# EAGLE schematic shupito (EAGLE 5.11)
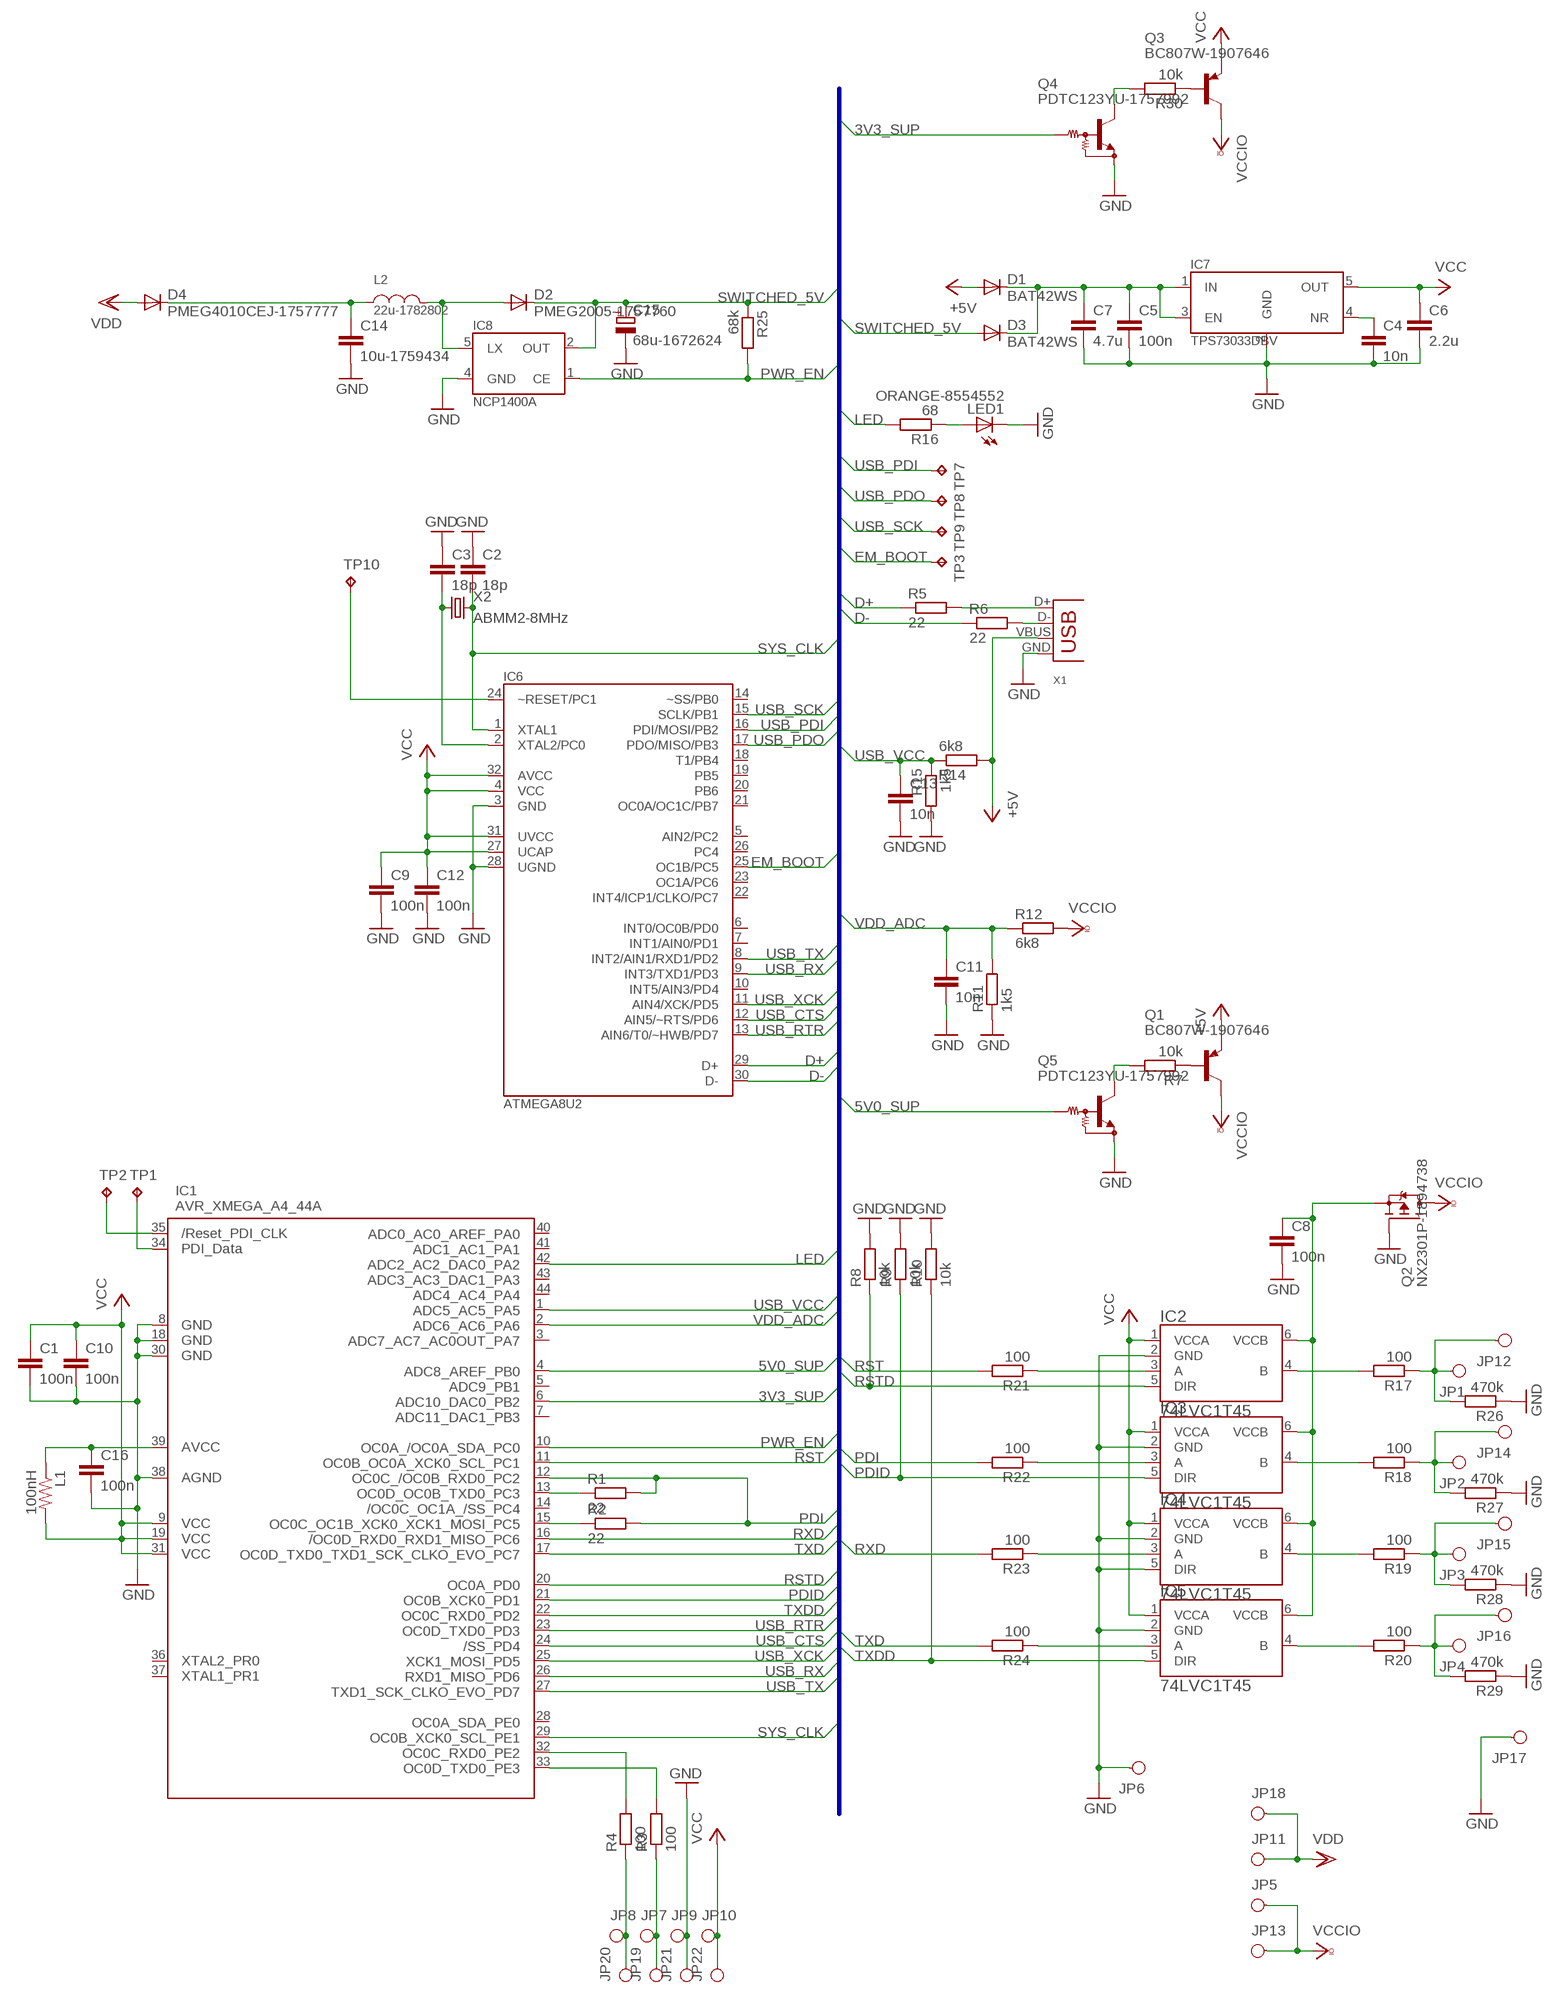
[diagram p0: schematic, sheet 1]

## Parts
C1  100n  C-EUC0603  [C0603]
C2  18p  C-EUC0603  [C0603]
C3  18p  C-EUC0603  [C0603]
C4  10n  C-EUC0603  [C0603]
C5  100n  C-EUC0603  [C0603]
C6  2.2u  C-EUC1206  [C1206]
C7  4.7u  C-EUC1206  [C1206]
C8  100n  C-EUC0603  [C0603]
C9  100n  C-EUC0603  [C0603]
C10  100n  C-EUC0603  [C0603]
C11  10n  C-EUC0603  [C0603]
C12  100n  C-EUC0603  [C0603]
C13  10n  C-EUC0603  [C0603]
C14  10u-1759434  C-EUC1206  [C1206]
C15  68u-1672624  CPOL-EUC/6032-28R  [C/6032-28R]
C16  100n  C-EUC0603  [C0603]
D1  BAT42WS  DIODE-SOD323  [SOD323]
D2  PMEG2005-1757760  DIODE-SOD323  [SOD323]
D3  BAT42WS  DIODE-SOD323  [SOD323]
D4  PMEG4010CEJ-1757777  DIODE-SOD323  [SOD323]
IC1  AVR_XMEGA_A4_44A  [TQFP44]
IC2  74LVC1T45  74LVC1T45DBV  [SOT236]
IC3  74LVC1T45  74LVC1T45DBV  [SOT236]
IC4  74LVC1T45  74LVC1T45DBV  [SOT236]
IC5  74LVC1T45  74LVC1T45DBV  [SOT236]
IC6  ATMEGA8U2  [TQFP32-08]
IC7  TPS73033DBV  [SOT23-DBV]
IC8  NCP1400A  [SOT23-DBV]
JP1  PINH1X01SMD  [PINH1X01SMD]
JP2  PINH1X01SMD  [PINH1X01SMD]
JP3  PINH1X01SMD  [PINH1X01SMD]
JP4  PINH1X01SMD  [PINH1X01SMD]
JP5  PINH1X01SMD  [PINH1X01SMD]
JP6  PINH1X01SMD  [PINH1X01SMD]
JP7  PINH1X01SMD  [PINH1X01SMD]
JP8  PINH1X01SMD  [PINH1X01SMD]
JP9  PINH1X01SMD  [PINH1X01SMD]
JP10  PINH1X01SMD  [PINH1X01SMD]
JP11  PINH1X01SMD  [PINH1X01SMD]
JP12  PINH1X01SMD  [PINH1X01SMD]
JP13  PINH1X01SMD  [PINH1X01SMD]
JP14  PINH1X01SMD  [PINH1X01SMD]
JP15  PINH1X01SMD  [PINH1X01SMD]
JP16  PINH1X01SMD  [PINH1X01SMD]
JP17  PINH1X01SMD  [PINH1X01SMD]
JP18  PINH1X01SMD  [PINH1X01SMD]
JP19  PINH1X01SMD  [PINH1X01SMD]
JP20  PINH1X01SMD  [PINH1X01SMD]
JP21  PINH1X01SMD  [PINH1X01SMD]
JP22  PINH1X01SMD  [PINH1X01SMD]
L1  100nH  R-US_R0603  [R0603]
L2  22u-1782802  L  [1515]
LED1  ORANGE-8554552  LEDCHIPLED_0603  [CHIPLED_0603]
Q1  BC807W-1907646  BC807W  [SOT323-BEC]
Q2  NX2301P-1894738  P-MOSFET-SOT23-GSD  [SOT23]
Q3  BC807W-1907646  BC807W  [SOT323-BEC]
Q4  PDTC123YU-1757992  NPN-BIAS-SOT323-BEC  [SOT323]
Q5  PDTC123YU-1757992  NPN-BIAS-SOT323-BEC  [SOT323]
R1  22  R-EU_R0603  [R0603]
R2  22  R-EU_R0603  [R0603]
R3  100  R-EU_R0603  [R0603]
R4  100  R-EU_R0603  [R0603]
R5  22  R-EU_R1206  [R1206]
R6  22  R-EU_R0603  [R0603]
R7  10k  R-EU_R0603  [R0603]
R8  10k  R-EU_R0603  [R0603]
R9  10k  R-EU_R0603  [R0603]
R10  10k  R-EU_R0603  [R0603]
R11  1k5  R-EU_R0603  [R0603]
R12  6k8  R-EU_R0603  [R0603]
R14  6k8  R-EU_R0603  [R0603]
R15  1k5  R-EU_R0603  [R0603]
R16  68  R-EU_R0603  [R0603]
R17  100  R-EU_R0603  [R0603]
R18  100  R-EU_R0603  [R0603]
R19  100  R-EU_R0603  [R0603]
R20  100  R-EU_R0603  [R0603]
R21  100  R-EU_R0603  [R0603]
R22  100  R-EU_R0603  [R0603]
R23  100  R-EU_R0603  [R0603]
R24  100  R-EU_R0603  [R0603]
R25  68k  R-EU_R0603  [R0603]
R26  470k  R-EU_R0603  [R0603]
R27  470k  R-EU_R0603  [R0603]
R28  470k  R-EU_R0603  [R0603]
R29  470k  R-EU_R0603  [R0603]
R30  10k  R-EU_R0603  [R0603]
TP1  TPTP15SQ  [TP15SQ]
TP2  TPTP15SQ  [TP15SQ]
TP3  TPTP15SQ  [TP15SQ]
TP7  TPTP15SQ  [TP15SQ]
TP8  TPTP15SQ  [TP15SQ]
TP9  TPTP15SQ  [TP15SQ]
TP10  TPTP15SQ  [TP15SQ]
X1  USB-MB-S  [USB-MB-S]
X2  ABMM2-8MHz  XTAL6X3.6_LARGE  [6X3.6_LARGE]

## Nets
3V3_SUP: IC1.6(PB2) Q4.1(B)
5V0_SUP: IC1.4(PB0) Q5.1(B)
+5V: D1.A Q1.2(E) R14.2 X1.VBUS
D+: IC6.29(D+) R5.1
D-: IC6.30(D-) R6.1
EM_BOOT: IC6.25(OC1B/PC5) TP3.TP
GND: C1.2 C2.1 C3.1 C4.2 C5.2 C6.2 C7.2 C8.2 C9.2 C10.2 C11.2 C12.2 C13.2 C14.2 C15.- C16.2 IC1.8(GND1) IC1.18(GND2) IC1.30(GND3) IC1.38(AGND) IC2.2(GND) IC3.2(GND) IC4.2(GND) IC4.5(DIR) IC5.2(GND) IC6.3(GND) IC6.28(UGND) IC7.2(GND) IC8.4(GND) JP6.1 JP9.1 JP17.1 JP21.1 LED1.C Q2.1(G) Q4.2(E) Q5.2(E) R8.2 R9.2 R10.2 R11.1 R15.2 R26.1 R27.1 R28.1 R29.1 X1.GND
LED: IC1.42(PA2) R16.2
N$1: JP7.1 JP19.1 R3.1
N$2: IC1.35(RESET) TP2.TP
N$3: IC1.34(PDI_DATA) TP1.TP
N$4: IC1.15(PC5) R2.1
N$5: IC2.4(B) R17.2
N$6: C16.1 IC1.39(AVCC) L1.1
N$7: JP2.1 JP14.1 R18.1 R27.2
N$8: IC1.13(PC3) R1.1
N$9: IC3.4(B) R18.2
N$10: JP8.1 JP20.1 R4.1
N$11: IC1.32(PE2) R4.2
N$12: IC1.33(PE3) R3.2
N$13: R6.2 X1.D-
N$14: R5.2 X1.D+
N$15: LED1.A R16.1
N$16: C14.1 D4.C L2.1
N$17: C4.1 IC7.4(NR)
N$18: IC6.24(~RESET/PC1) TP10.TP
N$19: Q1.1(B) R7.1
N$21: C5.1 C7.1 D1.C D3.C IC7.1(IN) IC7.3(EN)
N$22: D2.A IC8.5(LX) L2.2
N$23: Q5.3(C) R7.2
N$25: IC4.4(B) R19.2
N$26: Q4.3(C) R30.2
N$27: IC5.4(B) R20.2
N$28: Q3.1(B) R30.1
N$29: C8.1 IC2.6(VCCB) IC3.6(VCCB) IC4.6(VCCB) IC5.6(VCCB) Q2.2(S)
N$30: IC2.3(A) R21.1
N$31: IC3.3(A) R22.1
N$32: IC4.3(A) R23.1
N$33: IC5.3(A) R24.1
N$34: C3.2 IC6.2(XTAL2/PC0) X2.1
N$35: JP1.1 JP12.1 R17.1 R26.2
N$36: JP3.1 JP15.1 R19.1 R28.2
N$37: JP4.1 JP16.1 R20.1 R29.2
PDI: IC1.12(PC2) R1.2 R2.2 R22.2
PDID: IC1.21(PD1) IC3.5(DIR) R9.1
PWR_EN: IC1.10(PC0) IC8.1(CE) R25.2
RST: IC1.11(PC1) R21.2
RSTD: IC1.20(PD0) IC2.5(DIR) R8.1
RXD: IC1.16(PC6) R23.2
SWITCHED_5V: C15.+ D2.C D3.A IC8.2(OUT) R25.1
SYS_CLK: C2.2 IC1.29(PE1) IC6.1(XTAL1) X2.3
TXD: IC1.17(PC7) R24.2
TXDD: IC1.22(PD2) IC5.5(DIR) R10.1
USB_CTS: IC1.24(PD4) IC6.12(AIN5/~RTS/PD6)
USB_PDI: IC6.16(PDI/MOSI/PB2) TP7.TP
USB_PDO: IC6.17(PDO/MISO/PB3) TP8.TP
USB_RTR: IC1.23(PD3) IC6.13(AIN6/T0/~HWB/PD7)
USB_RX: IC1.26(PD6) IC6.9(INT3/TXD1/PD3)
USB_SCK: IC6.15(SCLK/PB1) TP9.TP
USB_TX: IC1.27(PD7) IC6.8(INT2/AIN1/RXD1/PD2)
USB_VCC: C13.1 IC1.1(PA5) R14.1 R15.1
USB_XCK: IC1.25(PD5) IC6.11(AIN4/XCK/PD5)
VCC: C1.1 C6.1 C9.1 C10.1 C12.1 IC1.9(VCC1) IC1.19(VCC2) IC1.31(VCC3) IC2.1(VCCA) IC3.1(VCCA) IC4.1(VCCA) IC5.1(VCCA) IC6.4(VCC) IC6.27(UCAP) IC6.31(UVCC) IC6.32(AVCC) IC7.5(OUT) JP10.1 JP22.1 L1.2 Q3.2(E)
VCCIO: JP5.1 JP13.1 Q1.3(C) Q2.3(D) Q3.3(C) R12.2
VDD: D4.A JP11.1 JP18.1
VDD_ADC: C11.1 IC1.2(PA6) R11.2 R12.1
Unconnected: IC1.3(PA7) IC1.5(PB1) IC1.7(PB3) IC1.14(PC4) IC1.28(PE0) IC1.36(PR0) IC1.37(PR1) IC1.40(PA0) IC1.41(PA1) IC1.43(PA3) IC1.44(PA4) IC6.5(AIN2/PC2) IC6.6(INT0/OC0B/PD0) IC6.7(INT1/AIN0/PD1) IC6.10(INT5/AIN3/PD4) IC6.14(~SS/PB0) IC6.18(T1/PB4) IC6.19(PB5) IC6.20(PB6) IC6.21(OC0A/OC1C/PB7) IC6.22(INT4/ICP1/CLKO/PC7) IC6.23(OC1A/PC6) IC6.26(PC4)

## Buses
RST,PDI,RXD,TXD,RSTD,PDID,TXDD,USB_RX,USB_TX,5V0_SUP,3V3_SUP,VDD_ADC,SYS_CLK,USB_XCK,PWR_EN,USB_VCC,D+,D-,USB_PDI,USB_PDO,USB_SCK,USB_RX,USB_TX,SYS_CLK,USB_XCK,LED,PWR_EN,SWITCHED_5V,EM_BOOT,USB_CTS,USB_RTR,SYS_CLK

## Library data of the parts
C1-C14 C16 = rcl:C-EU: CAPACITOR, European symbol
C15 = rcl:CPOL-EU: POLARIZED CAPACITOR, European symbol
D1-D4 = diode:DIODE: DIODE ultra fast-recovery rectifier
IC1 = xmega:AVR_XMEGA_A4_: Device for Atmel AVR XMEGA A4 Series
IC2-IC5 = 74lvc1t45:74*1T45
IC6 = atmega_u2:ATMEGA*U2
IC7 = tps73033:TPS73033
IC8 = ncp1400a:NCP1400A
JP1-JP22 = pinhead_smd:PINH1X01
L1 = rcl:R-US_: RESISTOR, American symbol
L2 = inductors:L
LED1 = led:LED: LED OSRAM: - CHIPLED LG R971, LG N971, LY N971, LG Q971, LY Q971, LO R971, LY R971 LH N974, LH R974 LS Q976, LO Q976, LY Q976 LO Q996 - Hyper CHIPLED LW Q18S LB Q993, LB Q99A, LB R99A - SideLED LS A670, LO A670, LY A670, LG A670, LP A670 LB A673, LV A673, LT A673, LW A673 LH A674 LY A675 LS A676, LA A676, LO A676, LY A676, LW A676 LS A679, LY A679, LG A679 - Hyper Micro SIDELED® LS Y876, LA Y876, LO Y876, LY Y876 LT Y87S - SmartLED LW L88C, LW L88S LB L89C, LB L89S, LG L890 LS L89K, LO L89K, LY L89K LS L896, LA L896, LO L896, LY L896 - TOPLED LS T670, LO T670, LY T670, LG T670, LP T670 LSG T670, LSP T670, LSY T670, LOP T670, LYG T670 LG T671, LOG T671, LSG T671 LB T673, LV T673, LT T673, LW T673 LH T674 LS T676, LA T676, LO T676, LY T676, LB T676, LH T676, LSB T676, LW T676 LB T67C, LV T67C, LT T67C, LS T67K, LO T67K, LY T67K, LW E67C LS E67B, LA E67B, LO E67B, LY E67B, LB E67C, LV E67C, LT E67C LW T67C LS T679, LY T679, LG T679 LS T770, LO T770, LY T770, LG T770, LP T770 LB T773, LV T773, LT T773, LW T773 LH T774 LS E675, LA E675, LY E675, LS T675 LS T776, LA T776, LO T776, LY T776, LB T776 LHGB T686 LT T68C, LB T68C - Hyper Mini TOPLED® LB M676 - Mini TOPLED Santana® LG M470 LS M47K, LO M47K, LY M47K Source: http://www.osram.convergy.de LUXEON: - LUMILED® LXK2-PW12-R00, LXK2-PW12-S00, LXK2-PW14-U00, LXK2-PW14-V00 LXK2-PM12-R00, LXK2-PM12-S00, LXK2-PM14-U00 LXK2-PE12-Q00, LXK2-PE12-R00, LXK2-PE12-S00, LXK2-PE14-T00, LXK2-PE14-U00 LXK2-PB12-K00, LXK2-PB12-L00, LXK2-PB12-M00, LXK2-PB14-N00, LXK2-PB14-P00, LXK2-PB14-Q00 LXK2-PR12-L00, LXK2-PR12-M00, LXK2-PR14-Q00, LXK2-PR14-R00 LXK2-PD12-Q00, LXK2-PD12-R00, LXK2-PD12-S00 LXK2-PH12-R00, LXK2-PH12-S00 LXK2-PL12-P00, LXK2-PL12-Q00, LXK2-PL12-R00 Source: www.luxeon.com KINGBRIGHT: KA-3528ASYC Source: www.kingbright.com
Q1 Q3 = transistor-pnp:BC807*: PNP Transistror
Q2 = transistors:P-MOSFET
Q4 Q5 = transistors:NPN-BIAS
R1-R12 R14-R30 = rcl:R-EU_: RESISTOR, European symbol
TP1-TP3 TP7-TP10 = testpad:TP: Test pad
X1 = con-usb-3:USB: USB Connectors
X2 = xtal:XTAL